# EAGLE design Controlador PID Analogico (EAGLE 7.6.0)
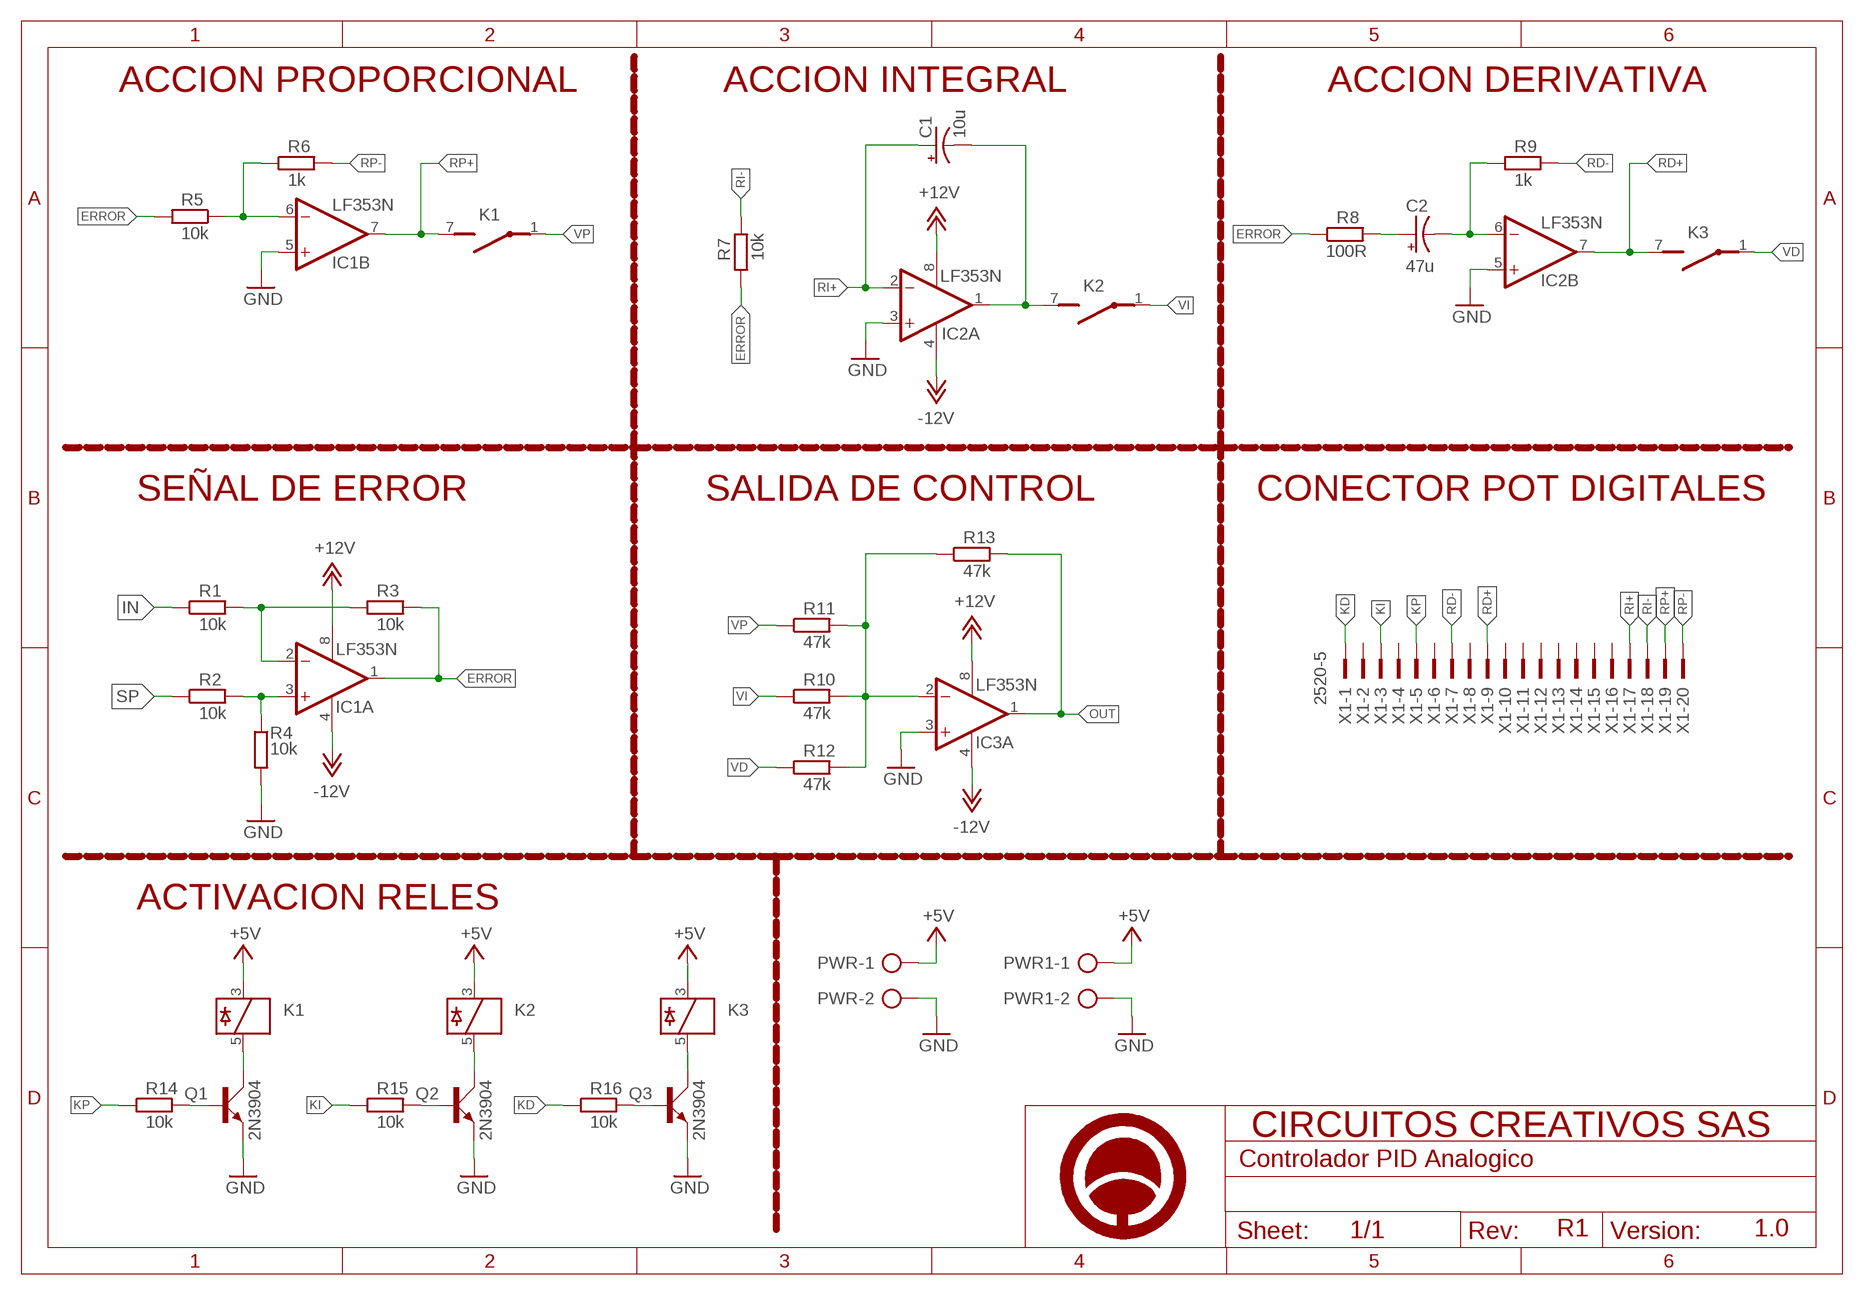
[diagram p0: schematic, sheet 1]

## Parts
C1  10u  CPOL-USE2,5-6E  [E2,5-6E]
C2  47u  CPOL-USE2,5-6E  [E2,5-6E]
IC1  LF353N  [DIL08]
IC2  LF353N  [DIL08]
IC3  LF353N  [DIL08]
K1  35701331  [REED]
K2  35701331  [REED]
K3  35701331  [REED]
PWR  AK500/2  [AK500/2]
PWR1  AK500/2  [AK500/2]
Q1  2N3904  [TO92D]
Q2  2N3904  [TO92D]
Q3  2N3904  [TO92D]
R1  10k  R-EU_0204/7  [0204/7]
R2  10k  R-EU_0204/7  [0204/7]
R3  10k  R-EU_0204/7  [0204/7]
R4  10k  R-EU_0204/7  [0204/7]
R5  10k  R-EU_0204/7  [0204/7]
R6  1k  R-EU_0204/7  [0204/7]
R7  10k  R-EU_0204/7  [0204/7]
R8  100R  R-EU_0204/7  [0204/7]
R9  1k  R-EU_0204/7  [0204/7]
R10  47k  R-EU_0204/7  [0204/7]
R11  47k  R-EU_0204/7  [0204/7]
R12  47k  R-EU_0204/7  [0204/7]
R13  47k  R-EU_0204/7  [0204/7]
R14  10k  R-EU_0204/7  [0204/7]
R15  10k  R-EU_0204/7  [0204/7]
R16  10k  R-EU_0204/7  [0204/7]
U$1  A4_HORIZONTAL  [LOGO]
X1  2520-5  [PAK100/2500-5-20]

## Nets
+5V: K1.3 K2.3 K3.3 PWR1.1 PWR.1
+12V: IC1.8(P:V+) IC2.8(P:V+) IC3.8(P:V+)
-12V: IC1.4(P:V-) IC2.4(P:V-) IC3.4(P:V-)
ERROR: IC1.1(A:OUT) R3.2 R5.2 R7.2 R8.1
GND: IC1.5(B:+IN) IC2.3(A:+IN) IC2.5(B:+IN) IC3.3(A:+IN) PWR1.2 PWR.2 Q1.E Q2.E Q3.E R4.2
IN: R1.1
KD: R16.1 X1.1
KI: R15.1 X1.3
KP: R14.1 X1.5
N$1: IC1.2(A:-IN) R1.2 R3.1
N$2: IC1.3(A:+IN) R2.2 R4.1
N$3: IC1.6(B:-IN) R5.1 R6.1
N$4: C1.- IC2.1(A:OUT) K2.7(2:S)
N$5: C2.- IC2.6(B:-IN) R9.1
N$6: C2.+ R8.2
N$7: IC3.2(A:-IN) R10.2 R11.2 R12.2 R13.1
N$8: Q1.B R14.2
N$9: K1.5 Q1.C
N$10: Q2.B R15.2
N$11: K2.5 Q2.C
N$12: Q3.B R16.2
N$13: K3.5 Q3.C
OUT: IC3.1(A:OUT) R13.2
RD+: IC2.7(B:OUT) K3.7(2:S) X1.9
RD-: R9.2 X1.7
RI+: C1.+ IC2.2(A:-IN) X1.17
RI-: R7.1 X1.18
RP+: IC1.7(B:OUT) K1.7(2:S) X1.19
RP-: R6.2 X1.20
SP: R2.1
VD: K3.1(2:P) R12.1
VI: K2.1(2:P) R10.1
VP: K1.1(2:P) R11.1
Unconnected: IC3.5(B:+IN) IC3.6(B:-IN) IC3.7(B:OUT) X1.2 X1.4 X1.6 X1.8 X1.10 X1.11 X1.12 X1.13 X1.14 X1.15 X1.16

## Notes on the sheet
- ACCION PROPORCIONAL | ACCION INTEGRAL | ACCION DERIVATIVA
- SEÑAL DE ERROR | SALIDA DE CONTROL | CONECTOR POT DIGITALES
- ACTIVACION RELES
- R1 | 1.0

## Library data of the parts
C1 C2 = rcl:CPOL-US: POLARIZED CAPACITOR, American symbol
IC1-IC3 = linear:LF353: OP AMP
K1-K3 = relay:35701331: RELAY reed, 1 x norm. open with polarity; OC_FARNELL: unknown; OC_NEWARK: unknown
PWR PWR1 = con-ptr500:AK500/2: CONNECTOR; OC_FARNELL: unknown; OC_NEWARK: unknown
Q1-Q3 = transistor-small-signal:2N3904: NPN TRANSISTOR
R1-R16 = rcl:R-EU_: RESISTOR, European symbol
U$1 = Circuitos-Creativos-Estilos:A4_HORIZONTAL
X1 = con-3m:2520-: 3M (TM) Pak 100 4-Wall Header Source: 3M; MPN: D2520-5002-AR; OC_FARNELL: unknown; OC_NEWARK: 12P7058

## Board
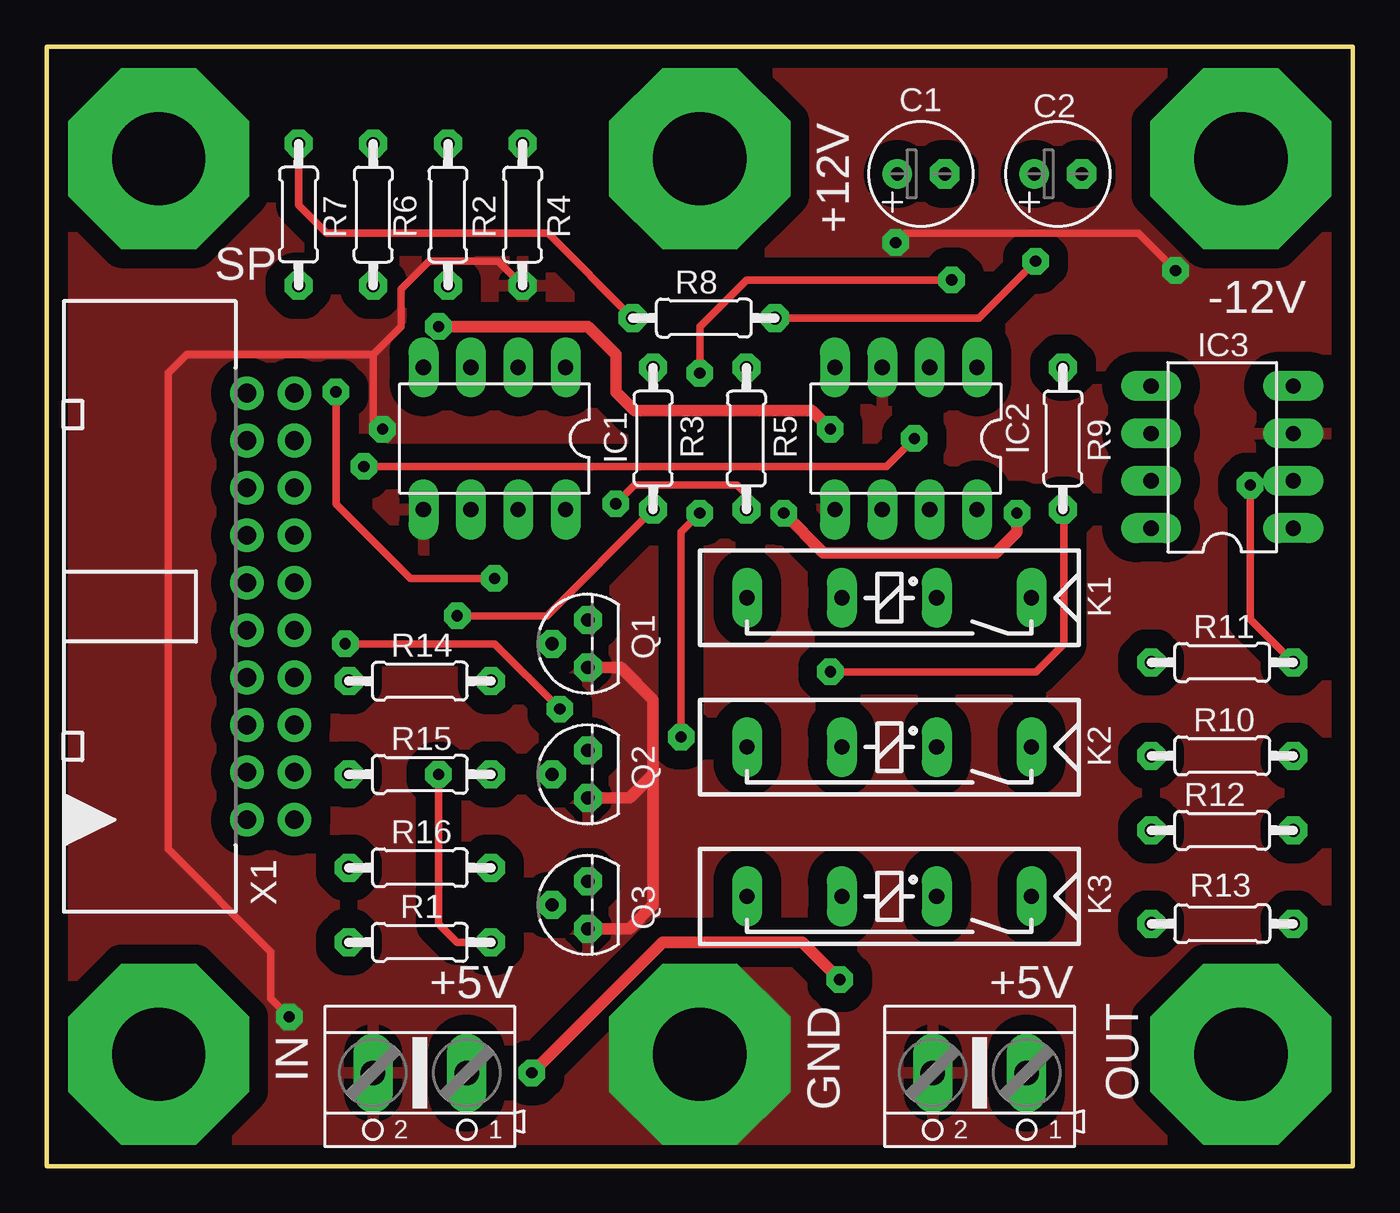
[diagram p1: board, top side]
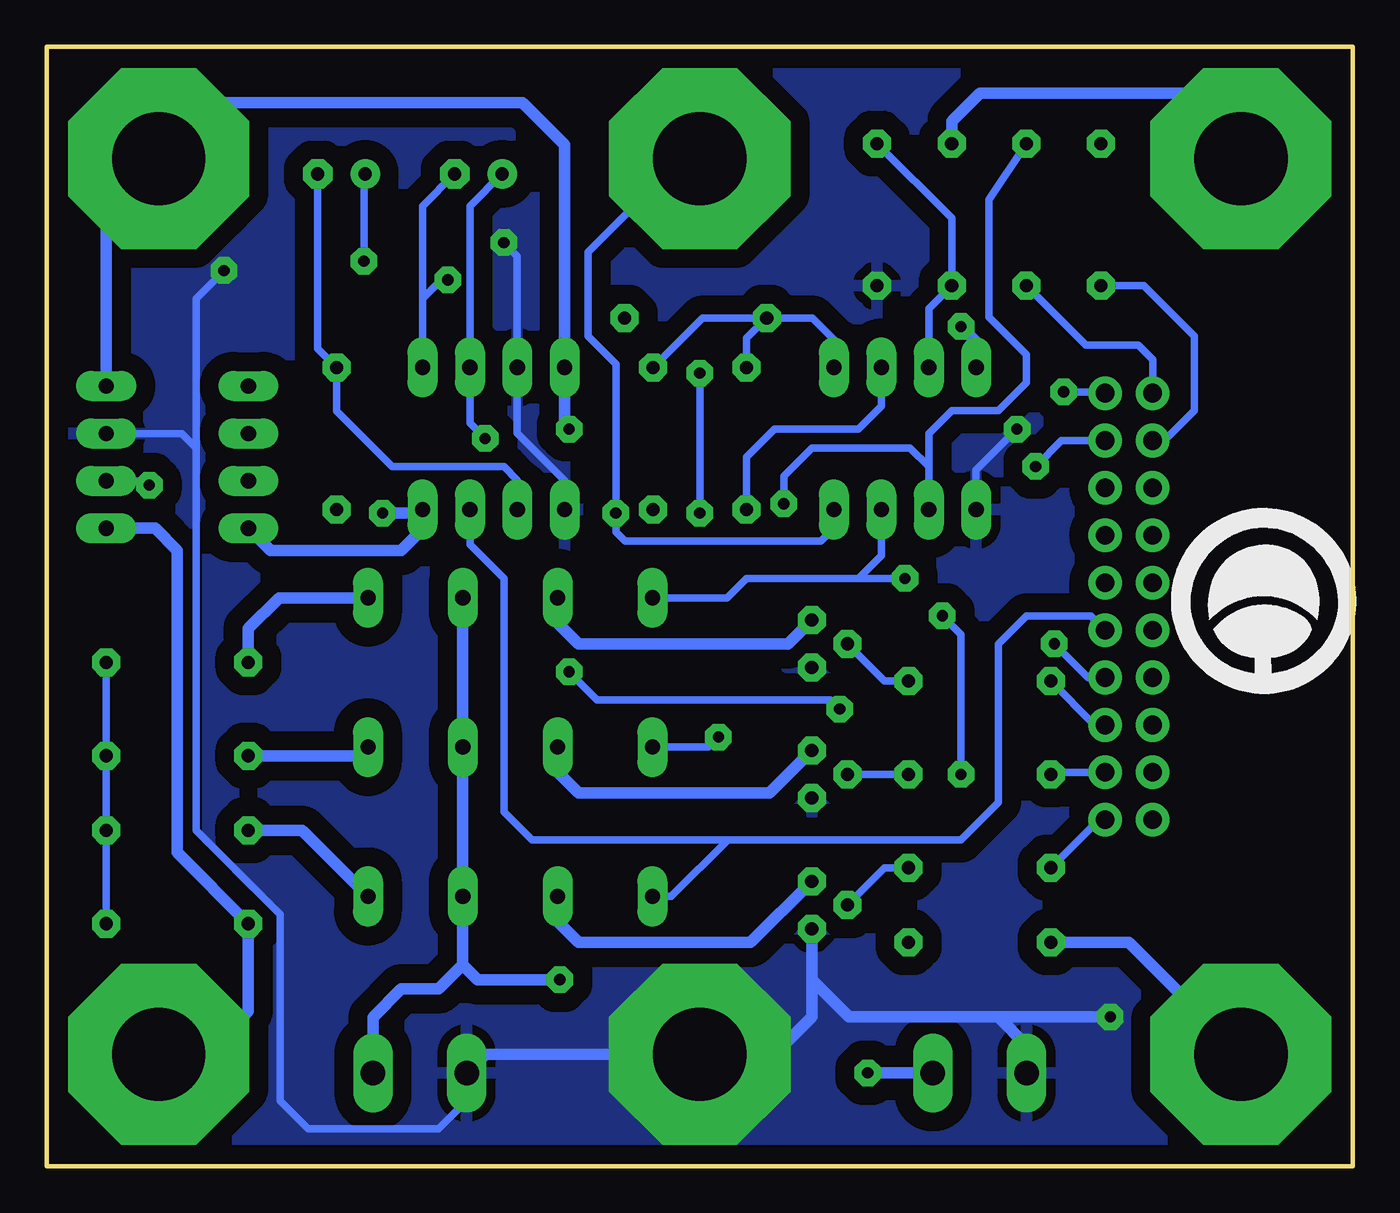
[diagram p2: board, bottom side, seen from below]

Size 70 x 60 mm. Coordinates in mm from the lower left corner, seen from the top.
Outline: 0,0 70,0 70,60 0,60 0,0
Copper layers (1*16): Top 0.035mm / dielectric 1.5mm / Bottom 0.035mm
Design rules "Circuitos_Creativos_2_capas": minimum track width 0.4mm, minimum drill 0.6mm, track to track 10mil, track to pad 10mil, pad to pad 10mil, via to via 10mil, smd to smd 8mil, copper to edge 1mm, drill to drill 15mil, minimum pad ring 0.4mm, minimum via ring 0.4mm, stop-mask expansion 4mil, vias tented up to drill 0mil, thermal gap 20mil

### Footprints (pad centres in the part's own frame; a part is rotated, then mirrored left to right if it is on the bottom)
E2,5-6E = drill 0.7 pad 1.575: + -1.27,0 | drill 0.7 pad 1.575 octagon: - 1.27,0
DIL08 = drill 0.813 pad 1.27 long: 1 -3.81,-3.81; 2 -1.27,-3.81; 3 1.27,-3.81; 4 3.81,-3.81; 5 3.81,3.81; 6 1.27,3.81; 7 -1.27,3.81; 8 -3.81,3.81
REED = drill 0.813 long: 1 -17.78,2.54; 3 -12.7,2.54; 5 -7.62,2.54; 7 -2.54,2.54
AK500/2 = drill 1.321 long: 1 -2.515,0; 2 2.515,0
TO92D = drill 0.7 pad 1.422 octagon: B 0,1.905; C 1.27,0; E -1.27,0
0204/7 = drill 0.7 pad 1.422 octagon: 1 -3.81,0; 2 3.81,0
PAK100/2500-5-20 = drill 1 pad 1.778: 1 -11.43,-1.27; 2 -11.43,1.27; 3 -8.89,-1.27; 4 -8.89,1.27; 5 -6.35,-1.27; 6 -6.35,1.27; 7 -3.81,-1.27; 8 -3.81,1.27; 9 -1.27,-1.27; 10 -1.27,1.27; 11 1.27,-1.27; 12 1.27,1.27; 13 3.81,-1.27; 14 3.81,1.27; 15 6.35,-1.27; 16 6.35,1.27; 17 8.89,-1.27; 18 8.89,1.27; 19 11.43,-1.27; 20 11.43,1.27

### Placement (x,y rotation side)
C1  46.86,53.18 0 top
C2  54.2,53.18 0 top
IC1  24,39 180 top
IC2  46.05,39 180 top
IC3  63,38 90 top
K1  35,33 180 top
K2  35,25 180 top
K3  35,17 180 top
PWR  20,5 180 top
PWR1  50,5 180 top
Q1  29,28 90 top
Q2  29,21 90 top
Q3  29,14 90 top
R1  20,12 0 top
R2  21.5,51 270 top
R3  32.5,39 90 top
R4  25.5,51 270 top
R5  37.5,39 90 top
R6  17.5,51 270 top
R7  13.5,51 90 top
R8  35.22,45.46 0 top
R9  54.46,39 270 top
R10  63,22 0 top
R11  63,27 0 top
R12  63,18 0 top
R13  63,13 180 top
R14  20,26 0 top
R15  20,21 0 top
R16  20,16 0 top
U$1  4.78,30.29 0 bottom
X1  12,30 90 top

### Tracks (layer width: path | path; a pad name or v marks a point on that pad's centre or on a via)
+5V  (via drill 0.6 pad 1.42)
  Top 0.61: v42.5,10 40.5,12 33,12 v26,5
  Bottom 0.61: 47.7,10.8 K3.3 K2.3 K1.3 | 47.7,10.8 49,9.5 51,9.5 52.52,7.99 PWR1.1 | 47.7,10.8 46.9,10 v42.5,10 | v26,5 PWR.1
+12V  (via drill 0.6 pad 1.42, 5 pad 9.7)
  Top 0.61: v52,35 52,34 50.88,32.88 41.62,32.88 v39.5,35
  Bottom 0.406: v35,54 36,54 41,49 41,44.5 39.5,43 v39.5,35 39.5,34 39,33.5 28.5,33.5 27.81,34.19 IC1.8
  Bottom 0.61: IC3.8 58,33 51,33 49.86,34.14 IC2.8 50.05,35 v52,35
-12V  (via drill 0.6 pad 1.42, 5 pad 9.7)
  Top 0.61: v21,45 29,45 30.5,43.5 30.5,41.5 31.5,40.5 41,40.5 v42,39.5
  Bottom 0.61: IC3.4 66.81,51.19 v64,54 61,57 44.5,57 42.24,54.74 IC2.4 42.24,39.74 v42,39.5 | IC1.4 20.19,44.19 v21,45
ERROR
  Top 0.406: R7.2 13.5,51.5 15,50 26.87,50 R8.1
  Bottom 0.406: R8.1 28.96,45.46 27.81,44.31 IC1.1 | R8.1 32.5,44.37 R3.2 | R5.2 34.85,45.46 R8.1
GND  (via drill 0.6 pad 1.42, 5 pad 9.7)
  Top 0.406: 17.5,43.5 19,45 19,47 20.5,48.5 24.19,48.5 R4.2 | 17.5,43.5 7.5,43.5 6.5,42.5 6.5,17 12,11.5 12,9 v13,8 | 17.5,43.5 17.5,40 v18,39.5 | v45.5,49.5 46,50 58.5,50 v60.5,48
  Top 0.61: Q1.E 30.77,26.73 32.5,25 32.5,21 | Q2.E 31.23,19.73 32.5,21 | 32.5,21 32.5,14 31.23,12.73 Q3.E
  Bottom 0.406: IC3.3 62.77,39.27 62,38.5 | 62,38.5 62,18 57.5,13.5 57.5,3.5 56,2 49,2 47.5,3.5 47.5,4.99 PWR1.2 | v18,39.5 20.19,37.31 IC1.5 | v45.5,49.5 44.78,48.78 IC2.3 44.78,39.28 42.24,36.74 IC2.5 | v60.5,48 62,46.5 62,38.5
  Bottom 0.61: Q3.E 29,10 | 29,10 29,8 31,6 v35,6 46.48,6 PWR1.2 | PWR.2 17.48,6.49 19,8 | v13,8 19,8 | 19,8 27,8 29,10
  pour Top (isolate 1.016): -1,-1 71,-1 71,61 -1,61
  pour Bottom (isolate 1.016): -2,-2 72,-2 72,62 -2,62
IN  (via drill 5 pad 9.7)
  Bottom 0.61: v6,6 12,12 R1.1
KD
  Bottom 0.406: X1.1 13.62,18.57 R16.1
KI
  Bottom 0.406: X1.3 16.08,21.11 R15.1
KP
  Bottom 0.406: X1.5 13.84,23.65 R14.1
N$1  (via drill 0.6 pad 1.42)
  Top 0.406: R3.1 26.81,29.5 v22,29.5 | v21,21 21,13 22,12 R1.2
  Bottom 0.406: IC1.2 25.27,40.73 26.5,39.5 31,39.5 32.5,38 R3.1 | v22,29.5 21,28.5 v21,21
N$2
  Bottom 0.406: IC1.3 22.73,45.96 R2.2 21.5,50.81 R4.1
N$3  (via drill 0.6 pad 1.42)
  Top 0.406: R5.1 37.5,36 37,36.5 31.5,36.5 v30.5,35.5
  Bottom 0.406: IC1.6 22.73,37.5 | 22.73,37.5 22.73,39.27 21.5,40.5 19,40.5 17.5,42 17.5,43.5 19.5,45.5 19.5,51.81 R6.1 | v30.5,35.5 30.5,37 29,38.5 23.73,38.5 22.73,37.5
N$4  (via drill 0.6 pad 1.42)
  Top 0.406: v34,23 34,34 v35,35 | v35,42.5 35,45 37.5,47.5 v48.5,47.5
  Bottom 0.406: C1.- 49.86,51.45 49.86,46.5 | 49.86,46.5 IC2.1 | K2.7 34.54,22.46 v34,23 | v35,35 v35,42.5 | v48.5,47.5 48.86,47.5 49.86,46.5
N$5
  Bottom 0.406: C2.- 55.47,43.82 R9.1 54.46,40.46 51.5,37.5 45.5,37.5 44.78,36.78 IC2.6
N$6  (via drill 0.6 pad 1.42)
  Top 0.406: R8.2 49.96,45.46 v53,48.5
  Bottom 0.406: v53,48.5 53,53.11 C2.+
N$7  (via drill 0.6 pad 1.42)
  Top 0.406: v64.5,36.5 64.5,29.31 R11.2
  Bottom 0.406: R11.2 R10.2 R12.2 R13.1 | IC3.2 64.73,36.73 v64.5,36.5
N$8
  Bottom 0.406: R14.2 25.09,26 Q1.B
N$9
  Bottom 0.61: K1.5 42.62,29.12 41.5,28 30.27,28 Q1.C
N$10
  Bottom 0.406: R15.2 Q2.B
N$11
  Bottom 0.61: K2.5 42.62,21.12 41.5,20 31.27,20 Q2.C
N$12
  Bottom 0.406: R16.2 25.09,16 Q3.B
N$13
  Bottom 0.61: K3.5 42.62,13.12 41.5,12 32.27,12 Q3.C
OUT  (via drill 5 pad 9.7)
  Bottom 0.61: v64,6 61.5,6 59.19,8.31 R13.2 63,16.81 63,33 64.19,34.19 IC3.1
RD+
  Bottom 0.406: K3.7 36.54,14.46 33.5,17.5 | 33.5,17.5 21,17.5 19,19.5 19,28 17.5,29.5 14.04,29.5 X1.9 | IC2.7 47.32,33.32 45.5,31.5 45.5,19 44,17.5 33.5,17.5
RD-  (via drill 0.6 pad 1.42)
  Top 0.406: v16,28 24,28 v27.5,24.5 | v42,26.5 53,26.5 54.5,28 54.5,35.15 R9.2
  Bottom 0.406: X1.7 14.19,26.19 v16,28 | v42,26.5 40.5,25 28,25 v27.5,24.5
RI+  (via drill 0.6 pad 1.42)
  Top 0.406: v17,37.5 45,37.5 v46.5,39
  Bottom 0.406: C1.+ 47.32,51.45 IC2.2 47.32,39.82 v46.5,39 | v17,37.5 15.61,38.89 X1.17
RI-
  Bottom 0.406: X1.18 10.11,38.89 8.5,40.5 8.5,44.5 11.19,47.19 R7.1
RP+  (via drill 0.6 pad 1.42)
  Top 0.406: v24,31.5 19.5,31.5 15.5,35.5 v15.5,41.5
  Bottom 0.406: K1.7 33.54,30.46 32.5,31.5 26.5,31.5 | 26.5,31.5 25.27,32.73 IC1.7 | X1.19 13.34,41.5 v15.5,41.5 | v24,31.5 26.5,31.5
RP-
  Bottom 0.406: X1.20 10.73,43.23 11.5,44 14.31,44 R6.2
SP  (via drill 5 pad 9.7)
  Bottom 0.61: v6,54 6,55.5 8,57.5 20,57.5 21.5,56 R2.1
VD
  Bottom 0.61: R12.1 56.32,18 K3.1
VI
  Bottom 0.61: R10.1 53.24,22 K2.1
VP
  Bottom 0.61: R11.1 59.19,28.81 57.54,30.46 K1.1

### Text on the board
tPlace: +12V | SP | -12V | +5V | +5V | IN | OUT | GND